# Altium project Camera.PrjPCB
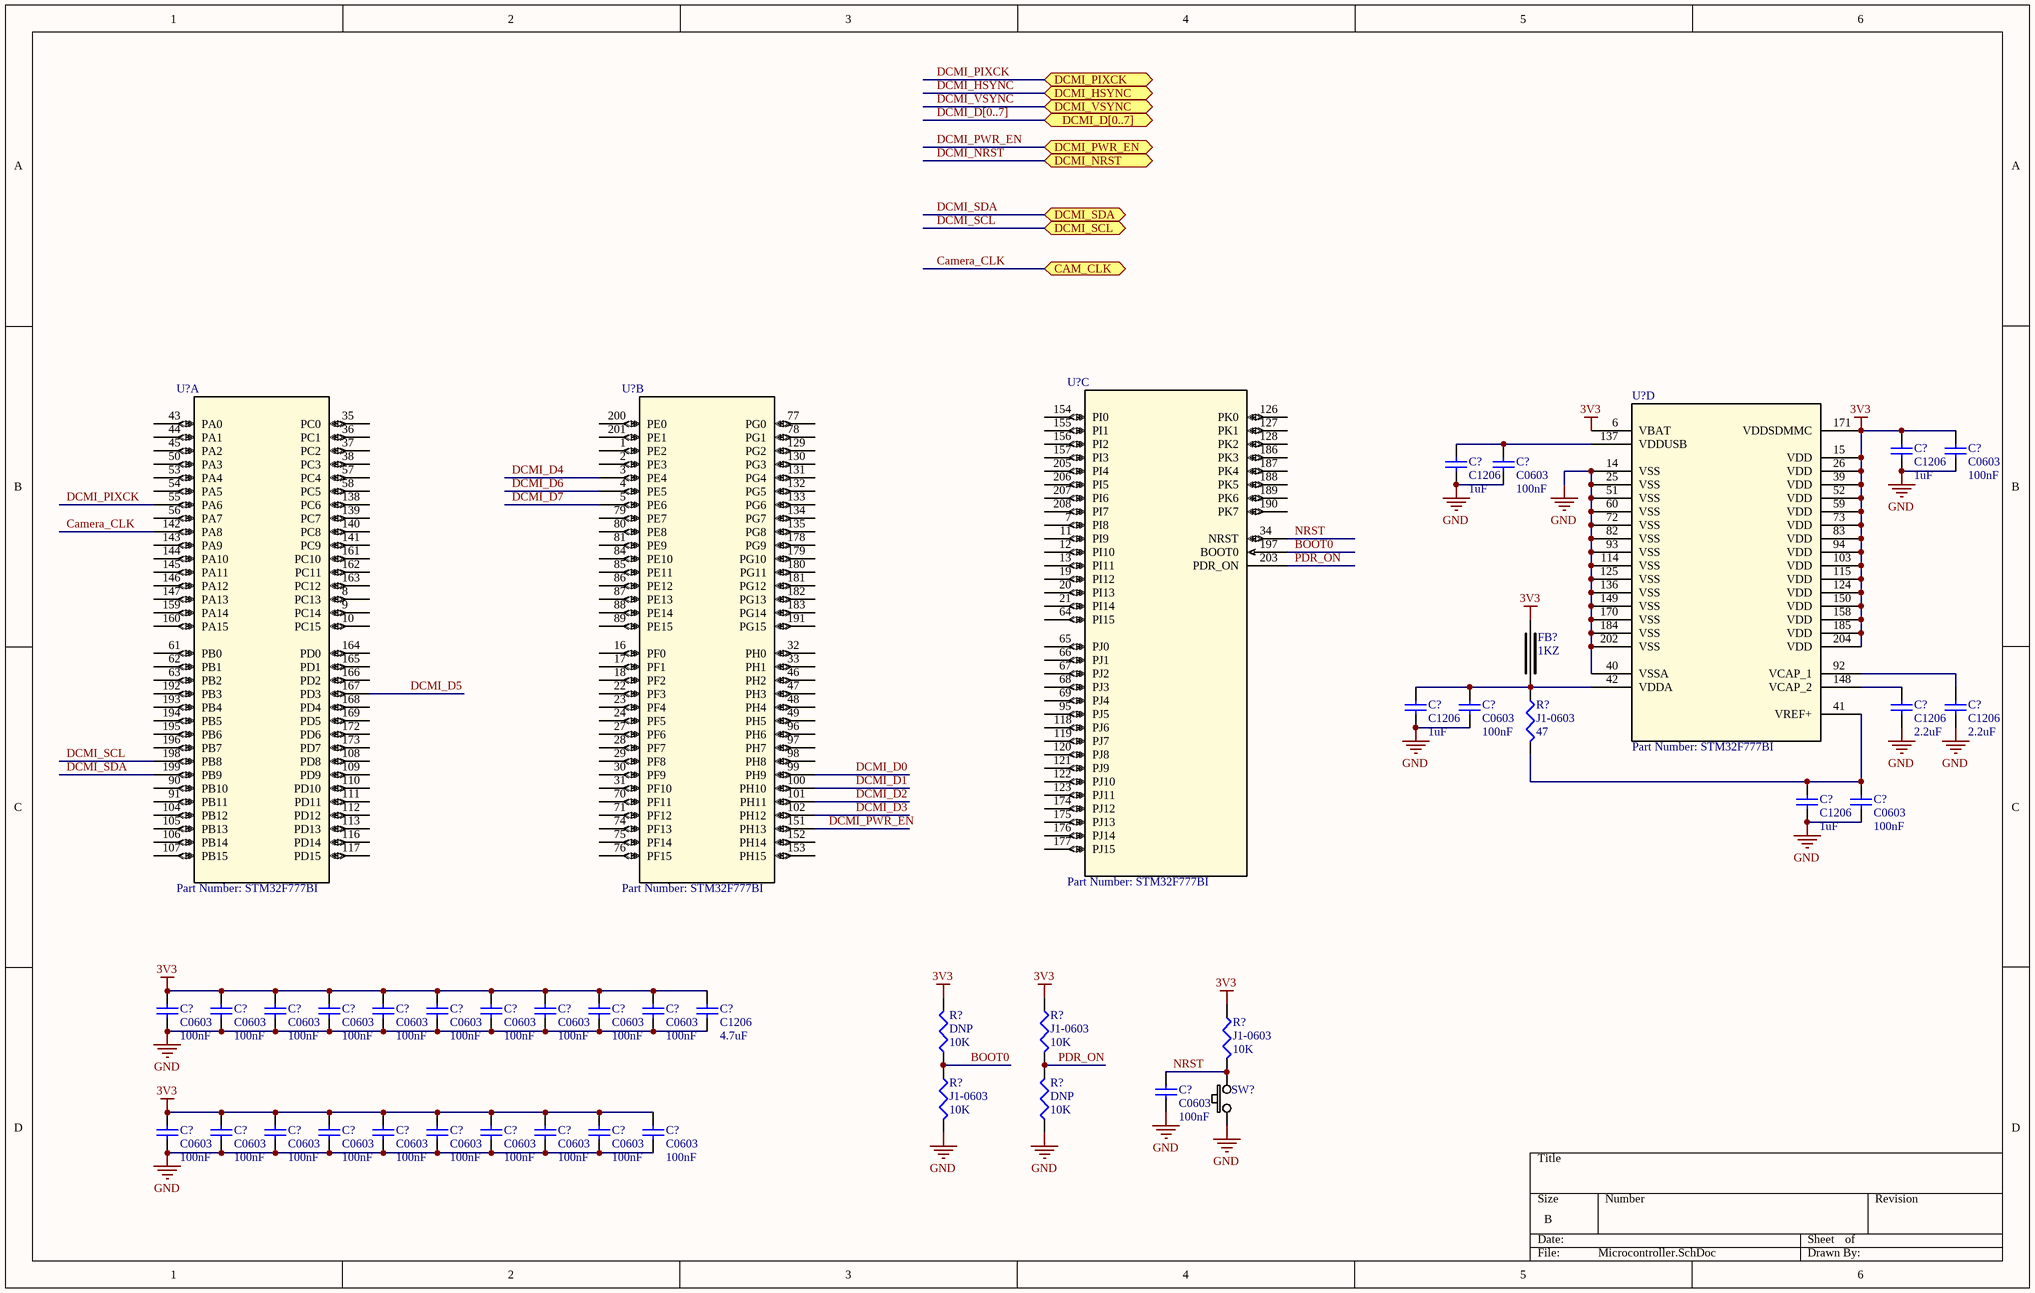
[diagram p0: Microcontroller.SchDoc]
4 sheets, 72 parts. Net scope: flat (ports and power ports of the same name join across sheets).
Sheets:
  Microcontroller.SchDoc
  Camera.SchDoc
  LCD.SchDoc
  Memory.SchDoc

## Sheet Microcontroller.SchDoc
size B

### Parts
(Parts that share a designator on the sheet are numbered #1, #2 ... from top to bottom, then left to right.)
C?#1  C1206  value 1uF  [C1206]
C?#2  C0603  value 100nF  [1608[0603]]
C?#3  C1206  value 1uF  [C1206]
C?#4  C0603  value 100nF  [1608[0603]]
C?#5  C1206  value 1uF  [C1206]
C?#6  C0603  value 100nF  [1608[0603]]
C?#7  C1206  value 2.2uF  [C1206]
C?#8  C1206  value 2.2uF  [C1206]
C?#9  C1206  value 1uF  [C1206]
C?#10  C0603  value 100nF  [1608[0603]]
C?#11  C0603  value 100nF  [1608[0603]]
C?#12  C0603  value 100nF  [1608[0603]]
C?#13  C0603  value 100nF  [1608[0603]]
C?#14  C0603  value 100nF  [1608[0603]]
C?#15  C0603  value 100nF  [1608[0603]]
C?#16  C0603  value 100nF  [1608[0603]]
C?#17  C0603  value 100nF  [1608[0603]]
C?#18  C0603  value 100nF  [1608[0603]]
C?#19  C0603  value 100nF  [1608[0603]]
C?#20  C0603  value 100nF  [1608[0603]]
C?#21  C1206  value 4.7uF  [C1206]
C?#22  C0603  value 100nF  [1608[0603]]
C?#23  C0603  value 100nF  [1608[0603]]
C?#24  C0603  value 100nF  [1608[0603]]
C?#25  C0603  value 100nF  [1608[0603]]
C?#26  C0603  value 100nF  [1608[0603]]
C?#27  C0603  value 100nF  [1608[0603]]
C?#28  C0603  value 100nF  [1608[0603]]
C?#29  C0603  value 100nF  [1608[0603]]
C?#30  C0603  value 100nF  [1608[0603]]
C?#31  C0603  value 100nF  [1608[0603]]
C?#32  C0603  value 100nF  [1608[0603]]
FB?  1KZ  [0603FB-1KZ]
R?#1  J1-0603  value 47  [RESC1608X06N]
R?#2  J1-0603  value 10K  [RESC1608X06N]
R?#3  J1-0603  value 10K  [RESC1608X06N]
R?#4  DNP  value 10K  [RESC1608X06N]
R?#5  J1-0603  value 10K  [RESC1608X06N]
R?#6  DNP  value 10K  [RESC1608X06N]
SW?  SW-PB-BLACK-SMD  [SW-PB-SMD]  (value not drawn)
U?#1  Part Number: STM32F777BI  [LQFP-208_28X28]  (part C of 4)
U?#2  Part Number: STM32F777BI  [LQFP-208_28X28]  (part A of 4)
U?#3  Part Number: STM32F777BI  [LQFP-208_28X28]  (part B of 4)
U?#4  Part Number: STM32F777BI  [LQFP-208_28X28]  (part D of 4)

### Ports
CAM_CLK, DCMI_D[0..7], DCMI_HSYNC, DCMI_NRST, DCMI_PIXCK, DCMI_PWR_EN, DCMI_SCL, DCMI_SDA, DCMI_VSYNC

### Nets
3V3: C?#1.2 C?#2.2 C?#11.2 C?#12.2 C?#13.2 C?#14.2 C?#15.2 C?#16.2 C?#17.2 C?#18.2 C?#19.2 C?#20.2 C?#21.2 C?#23.2 C?#24.2 C?#25.2 C?#26.2 C?#27.2 C?#28.2 C?#29.2 C?#30.2 C?#31.2 C?#32.2 FB?.1 R?#2.1 R?#3.1 R?#4.2 U?#4.6(VBAT) U?#4.15(VDD) U?#4.26(VDD) U?#4.39(VDD) U?#4.52(VDD) U?#4.59(VDD) U?#4.73(VDD) U?#4.83(VDD) U?#4.94(VDD) U?#4.103(VDD) U?#4.115(VDD) U?#4.124(VDD) U?#4.150(VDD) U?#4.158(VDD) U?#4.171(VDDSDMMC) U?#4.185(VDD) U?#4.204(VDD)
GND: C?#1.1 C?#2.1 C?#3.1 C?#4.1 C?#5.1 C?#6.1 C?#7.1 C?#8.1 C?#9.1 C?#10.1 C?#11.1 C?#12.1 C?#13.1 C?#14.1 C?#15.1 C?#16.1 C?#17.1 C?#18.1 C?#19.1 C?#20.1 C?#21.1 C?#22.1 C?#23.1 C?#24.1 C?#25.1 C?#26.1 C?#27.1 C?#28.1 C?#29.1 C?#30.1 C?#31.1 C?#32.1 R?#5.2 R?#6.1 SW?.1 U?#4.14(VSS) U?#4.25(VSS) U?#4.40(VSSA) U?#4.51(VSS) U?#4.60(VSS) U?#4.72(VSS) U?#4.82(VSS) U?#4.93(VSS) U?#4.114(VSS) U?#4.125(VSS) U?#4.136(VSS) U?#4.149(VSS) U?#4.170(VSS) U?#4.184(VSS) U?#4.202(VSS)
BOOT0: R?#4.1 R?#5.1 U?#1.197(BOOT0)
Camera_CLK: U?#2.142(PA8) ; port CAM_CLK
DCMI_D0: U?#3.99(PH9)
DCMI_D1: U?#3.100(PH10)
DCMI_D2: U?#3.101(PH11)
DCMI_D3: U?#3.102(PH12)
DCMI_D4: U?#3.3(PE4)
DCMI_D5: U?#2.167(PD3)
DCMI_D6: U?#3.4(PE5)
DCMI_D7: U?#3.5(PE6)
DCMI_PIXCK: U?#2.55(PA6) ; port DCMI_PIXCK
DCMI_PWR_EN: U?#3.151(PH13) ; port DCMI_PWR_EN
DCMI_SCL: U?#2.198(PB8) ; port DCMI_SCL
DCMI_SDA: U?#2.199(PB9) ; port DCMI_SDA
NRST: C?#22.2 R?#3.2 SW?.2 U?#1.34(NRST)
PDR_ON: R?#2.2 R?#6.2 U?#1.203(PDR_ON)
NetC?#3_2: C?#3.2 C?#4.2 U?#4.137(VDDUSB)
NetC?#5_2: C?#5.2 C?#6.2 FB?.2 R?#1.1 U?#4.42(VDDA)
NetC?#7_2: C?#7.2 U?#4.148(VCAP_2)
NetC?#8_2: C?#8.2 U?#4.92(VCAP_1)
NetC?#9_2: C?#9.2 C?#10.2 R?#1.2 U?#4.41(VREF+)

Not connected (* = marked no-connect by the designer): U?#1 7(PI8) 11(PI9) 12(PI10) 13(PI11) 19(PI12) 20(PI13) 21(PI14) 64(PI15) 65(PJ0) 66(PJ1) 67(PJ2) 68(PJ3) 69(PJ4) 95(PJ5) 118(PJ6) 119(PJ7) 120(PJ8) 121(PJ9) 122(PJ10) 123(PJ11) 126(PK0) 127(PK1) 128(PK2) 154(PI0) 155(PI1) 156(PI2) 157(PI3) 174(PJ12) 175(PJ13) 176(PJ14) 177(PJ15) 186(PK3) 187(PK4) 188(PK5) 189(PK6) 190(PK7) 205(PI4) 206(PI5) 207(PI6) 208(PI7); U?#2 8(PC13) 9(PC14) 10(PC15) 35(PC0) 36(PC1) 37(PC2) 38(PC3) 43(PA0) 44(PA1) 45(PA2) 50(PA3) 53(PA4) 54(PA5) 56(PA7) 57(PC4) 58(PC5) 61(PB0) 62(PB1) 63(PB2) 90(PB10) 91(PB11) 104(PB12) 105(PB13) 106(PB14) 107(PB15) 108(PD8) 109(PD9) 110(PD10) 111(PD11) 112(PD12) 113(PD13) 116(PD14) 117(PD15) 138(PC6) 139(PC7) 140(PC8) 141(PC9) 143(PA9) 144(PA10) 145(PA11) 146(PA12) 147(PA13) 159(PA14) 160(PA15) 161(PC10) 162(PC11) 163(PC12) 164(PD0) 165(PD1) 166(PD2) 168(PD4) 169(PD5) 172(PD6) 173(PD7) 192(PB3) 193(PB4) 194(PB5) 195(PB6) 196(PB7); U?#3 1(PE2) 2(PE3) 16(PF0) 17(PF1) 18(PF2) 22(PF3) 23(PF4) 24(PF5) 27(PF6) 28(PF7) 29(PF8) 30(PF9) 31(PF10) 32(PH0) 33(PH1) 46(PH2) 47(PH3) 48(PH4) 49(PH5) 70(PF11) 71(PF12) 74(PF13) 75(PF14) 76(PF15) 77(PG0) 78(PG1) 79(PE7) 80(PE8) 81(PE9) 84(PE10) 85(PE11) 86(PE12) 87(PE13) 88(PE14) 89(PE15) 96(PH6) 97(PH7) 98(PH8) 129(PG2) 130(PG3) 131(PG4) 132(PG5) 133(PG6) 134(PG7) 135(PG8) 152(PH14) 153(PH15) 178(PG9) 179(PG10) 180(PG11) 181(PG12) 182(PG13) 183(PG14) 191(PG15) 200(PE0) 201(PE1)

### Buses and harness runs
bus DCMI_D[0..7] = port DCMI_D[0..7]

### Library data of the parts
C?#1-C?#32 = Cap Semi: Capacitor (Semiconductor SIM Model); Published: 8-Jun-2000; LatestRevisionDate: 29-May-2009; LatestRevisionNote: IPC-7351 Footprint Added.; Publisher: Altium Limited; PackageDescription: Chip Capacitor
  C?#1 C?#3 C?#5 C?#7-C?#9 C?#21: PackageReference: C1206
  C?#2 C?#4 C?#6 C?#10-C?#20 C?#22-C?#32: PackageReference: C0603
FB? = 0603FB-1KZ: FERRITE BEAD 1000 OHM 400mA; Manufacturer: TDK Corporation; Manufacturer Part Number: MMZ1608R102A; Reel: F1; Description: FERRITE CHIP 1000 OHM 400MA 0603; Supplier 1: Digi-Key; Supplier Part Number 1: 445-1548-2-ND
R?#1-R?#6 = Res3: Resistor; Published: 8-Jun-2000; LatestRevisionDate: 29-May-2009; LatestRevisionNote: IPC-7351 Footprint Added.; PackageReference: J1-0603; Publisher: Altium Limited; PackageDescription: Chip Resistor
SW? = SW-PB-BLACK-SMD: PUSHBUTTON SWITCH 6MM SMD
U?#1-U?#4 = STM32F77XBXT: No Description Available; Vendor: STMicroelectronics; Manufacturer_Part_Number: STM32F777BI; Copyright: Copyright (C) 2016 Accelerated Designs. All rights reserved; RefDes: RefDes; Type: DEV; Value: Value

## Sheet Camera.SchDoc
size B
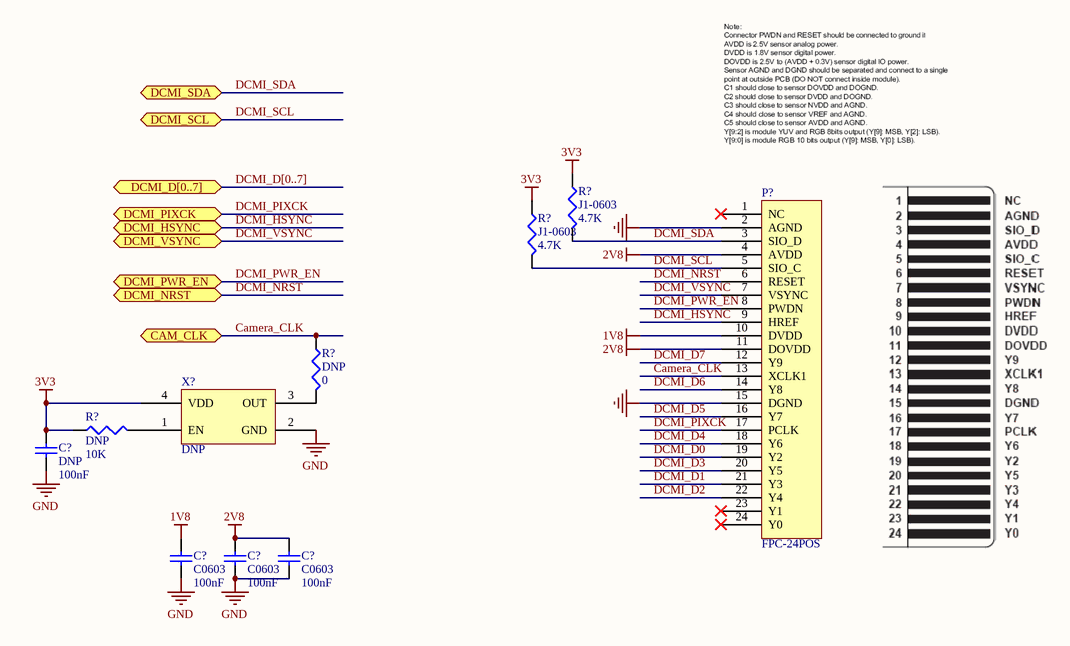
[diagram p1: Camera.SchDoc]

### Parts
(Parts that share a designator on the sheet are numbered #1, #2 ... from top to bottom, then left to right.)
C?#33  DNP  value 100nF  [1608[0603]]
C?#34  C0603  value 100nF  [1608[0603]]
C?#35  C0603  value 100nF  [1608[0603]]
C?#36  C0603  value 100nF  [1608[0603]]
P?  FPC-24POS
R?#7  J1-0603  value 4.7K  [RESC1608X06N]
R?#8  J1-0603  value 4.7K  [RESC1608X06N]
R?#9  DNP  value 0  [RESC1608X06N]
R?#10  DNP  value 10K  [RESC1608X06N]
X?  DNP  [XOSC-5X7]

### Ports
CAM_CLK, DCMI_D[0..7], DCMI_HSYNC, DCMI_NRST, DCMI_PIXCK, DCMI_PWR_EN, DCMI_SCL, DCMI_SDA, DCMI_VSYNC

### Nets
1V8: C?#34.2 P?.10(DVDD)
2V8: C?#35.2 C?#36.2 P?.4(AVDD) P?.11(DOVDD)
3V3: C?#33.2 R?#7.1 R?#8.1 R?#10.1 X?.4(VDD)
GND: C?#33.1 C?#34.1 C?#35.1 C?#36.1 P?.2(AGND) P?.15(DGND) X?.2(GND)
Camera_CLK: P?.13(XCLK1) R?#9.1 ; port CAM_CLK
DCMI_D0: P?.19(Y2)
DCMI_D1: P?.21(Y3)
DCMI_D2: P?.22(Y4)
DCMI_D3: P?.20(Y5)
DCMI_D4: P?.18(Y6)
DCMI_D5: P?.16(Y7)
DCMI_D6: P?.14(Y8)
DCMI_D7: P?.12(Y9)
DCMI_HSYNC: P?.9(HREF) ; port DCMI_HSYNC
DCMI_NRST: P?.6(RESET) ; port DCMI_NRST
DCMI_PIXCK: P?.17(PCLK) ; port DCMI_PIXCK
DCMI_PWR_EN: P?.8(PWDN) ; port DCMI_PWR_EN
DCMI_SCL: P?.5(SIO_C) R?#8.2 ; port DCMI_SCL
DCMI_SDA: P?.3(SIO_D) R?#7.2 ; port DCMI_SDA
DCMI_VSYNC: P?.7(VSYNC) ; port DCMI_VSYNC
NetR?#9_2: R?#9.2 X?.3(OUT)
NetR?#10_2: R?#10.2 X?.1(EN)

Not connected (* = marked no-connect by the designer): P? 1(NC)* 23(Y1)* 24(Y0)*

### Buses and harness runs
bus DCMI_D[0..7] = port DCMI_D[0..7]

### Library data of the parts
C?#33-C?#36 = Cap Semi: Capacitor (Semiconductor SIM Model); Published: 8-Jun-2000; LatestRevisionDate: 29-May-2009; LatestRevisionNote: IPC-7351 Footprint Added.; PackageReference: C0603; Publisher: Altium Limited; PackageDescription: Chip Capacitor
P? = CONN-FPC-24POS: 24POS Flat Printed Circuit (FPC) Connector; Suppler Part Number 1: SFV24R-4STBE1HLF
R?#7-R?#10 = Res3: Resistor; Published: 8-Jun-2000; LatestRevisionDate: 29-May-2009; LatestRevisionNote: IPC-7351 Footprint Added.; PackageReference: J1-0603; Publisher: Altium Limited; PackageDescription: Chip Resistor
X? = OSC_GENERIC: Generic Crystal Oscillator; frequency: *

## Sheet LCD.SchDoc
size B
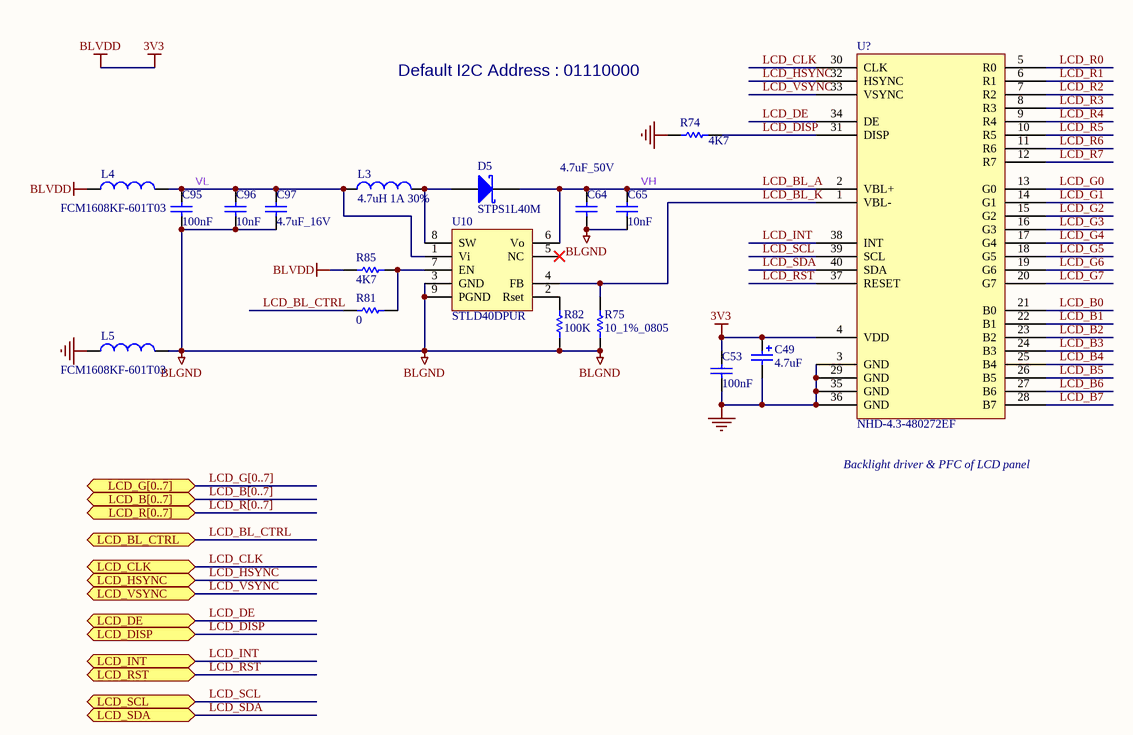
[diagram p2: LCD.SchDoc]

### Parts
(Parts that share a designator on the sheet are numbered #1, #2 ... from top to bottom, then left to right.)
C49  4.7uF  [TAN-A]
C53  100nF  [0402C]
C64  4.7uF_50V  [1206C]
C65  10nF  [0603C]
C95  100nF  [0603C]
C96  10nF  [0603C]
C97  4.7uF_16V  [1206C]
D5  STPS1L40M  [DO216-AA]
L3  4.7uH 1A 30%  [1210L]
L4  FCM1608KF-601T03  [0603L]
L5  FCM1608KF-601T03  [0603L]
R74  4K7  [0402R]
R75  10_1%_0805  [0805R]
R81  0  [0402R]
R82  100K  [0402R]
R85  4K7  [0402R]
U10  STLD40DPUR  [QFN8_0R65_3X3_ST]
U?#5  NHD-4.3-480272EF  [RK043FN48H]

### Ports
LCD_B[0..7], LCD_BL_CTRL, LCD_CLK, LCD_DE, LCD_DISP, LCD_G[0..7], LCD_HSYNC, LCD_INT, LCD_R[0..7], LCD_RST, LCD_SCL, LCD_SDA, LCD_VSYNC

### Nets
3V3: C49.1 C53.2 L4.1 R85.2 U?#5.4(VDD)  [also labelled BLVDD]
BLGND: C64.2 C65.1 C95.1 C96.1 C97.2 L5.2 R75.1 R82.2 U10.3(GND) U10.9(PGND)
GND: C49.2 C53.1 L5.1 R74.2 U?#5.3(GND) U?#5.29(GND) U?#5.35(GND) U?#5.36(GND)
LCD_B0: U?#5.21(B0)
LCD_B1: U?#5.22(B1)
LCD_B2: U?#5.23(B2)
LCD_B3: U?#5.24(B3)
LCD_B4: U?#5.25(B4)
LCD_B5: U?#5.26(B5)
LCD_B6: U?#5.27(B6)
LCD_B7: U?#5.28(B7)
LCD_BL_A: C64.1 C65.2 D5.2(K) U10.6(Vo) U?#5.2(VBL+)  [also labelled VH]
LCD_BL_CTRL: R81.2 ; port LCD_BL_CTRL
LCD_BL_K: R75.2 U10.4(FB) U?#5.1(VBL-)
LCD_CLK: U?#5.30(CLK) ; port LCD_CLK
LCD_DE: U?#5.34(DE) ; port LCD_DE
LCD_DISP: R74.1 U?#5.31(DISP) ; port LCD_DISP
LCD_G0: U?#5.13(G0)
LCD_G1: U?#5.14(G1)
LCD_G2: U?#5.15(G2)
LCD_G3: U?#5.16(G3)
LCD_G4: U?#5.17(G4)
LCD_G5: U?#5.18(G5)
LCD_G6: U?#5.19(G6)
LCD_G7: U?#5.20(G7)
LCD_HSYNC: U?#5.32(HSYNC) ; port LCD_HSYNC
LCD_INT: U?#5.38(INT) ; port LCD_INT
LCD_R0: U?#5.5(R0)
LCD_R1: U?#5.6(R1)
LCD_R2: U?#5.7(R2)
LCD_R3: U?#5.8(R3)
LCD_R4: U?#5.9(R4)
LCD_R5: U?#5.10(R5)
LCD_R6: U?#5.11(R6)
LCD_R7: U?#5.12(R7)
LCD_RST: U?#5.37(RESET) ; port LCD_RST
LCD_SCL: U?#5.39(SCL) ; port LCD_SCL
LCD_SDA: U?#5.40(SDA) ; port LCD_SDA
LCD_VSYNC: U?#5.33(VSYNC) ; port LCD_VSYNC
VL: C95.2 C96.2 C97.1 L3.1 L4.2 U10.1(Vi)
NetD5_1: D5.1(A) L3.2 U10.8(SW)
NetR81_1: R81.1 R85.1 U10.7(EN)
NetR82_1: R82.1 U10.2(Rset)

Not connected (* = marked no-connect by the designer): U10 5(NC)*

### Buses and harness runs
bus LCD_B[0..7] = port LCD_B[0..7]
bus LCD_G[0..7] = port LCD_G[0..7]
bus LCD_R[0..7] = port LCD_R[0..7]

### Notes on the sheet
- Default I2C Address : 01110000
- Backlight driver & PFC of LCD panel

### Library data of the parts
C49 = Cap_4.7uF_POL_10%_TANA: Polarized Capacitor,4.7uF,16V,10%,typeA,AVX; Manuf_Part_1: TAJA475K016R; Revision: July-2002: Re-released for DXP Platform.; Value: 4.7uF; Manuf_1: AVX; Order: TAJA475K016R; ECCN_US/EU: n/a
C53 = Cap_100nF_X7R_10%_0402: Capacitor,100nF,16V,X7R,10%,0402,YAGEO; Manuf_Part_1: CC0402KRX7R7BB104; Revision: July-2002: Re-released for DXP Platform.; Value: 100nF; Order: CC0402KRX7R7BB104; Manuf_1: YAGEO; ECCN_US/EU: n/a
C64 = Cap_4.7uF_X7R_10%_1206: Capacitor,4.7uF,50V, X7R,10%,1206,AVX; Manuf_Part_1: 12065C475KAT2A; Revision: July-2002: Re-released for DXP Platform.; Value: 4.7uF; Order: *; Manuf_1: AVX; ECCN_US/EU: n/a; Distrib: FARNELL
C65 C96 = Cap_10nF_X7R_10%_0603: Capacitor,10nF,50V,X7R,10%,0603,YAGEO; Manuf_Part_1: CC0603KRX7R9BB103; Revision: July-2002: Re-released for DXP Platform.; Value: 10nF; Order: CC0603KRX7R9BB103; Manuf_1: YAGEO; ECCN_US/EU: n/a
C95 = Cap_100nF_X7R_10%_0603: Capacitor,100nF,16V,X7R,10%,0603,YAGEO; Manuf_Part_1: CC0603KRX7R9BB104; Revision: July-2002: Re-released for DXP Platform.; Value: 100nF; Order: CC0603KRX7R9BB104; Manuf_1: YAGEO; ECCN_US/EU: n/a
C97 = Cap_4.7uF_X5R_10%_1206: Capacitor,4.7uF,16V, X5R,10%,1206,AVX; Manuf_Part_1: 1206YD475KAT2A; Revision: July-2002: Re-released for DXP Platform.; Value: 4.7uF; Order: *; Manuf_1: AVX; ECCN_US/EU: n/a; Distrib: FARNELL
D5 = STPS1L40M: Low Drop power Schottky rectifier(1A, 40V, 0.4V); Manuf_1: STM; Provided: ST; Ref St: 9151085; ECCN_US/EU: EAR99/NEC; Manuf_Part_1: STPS1L40M; Order: STPS1L40M; Distrib: ST; Code - JEDEC: *
L3 = Ind_4.7uH_1A_30%: FIXED IND 4.7UH 1A 180 MOHM 30% SMD; Manuf_Part_1: LQH32PN4R7NN0L; Manuf_1: MURATA; Order: 490-5338-1-ND; Distrib: DIGIKEY; ECCN_US/EU: n/a
L4 L5 = BEAD_600R_350MA_0603: Bead,600R,350mA,0603,FCM1608KF-601T03,Tai-tech; Manuf_2: TDK; Manuf_Part_2: MPZ1608S300A; Manuf_Part_3: BLM18PG121SN1D; Manuf_3: MURATA; Value: 100uH; Description_2: Bead,30R,5A,0603,MPZ1608S300A,TDK; Description_3: Bead,120R,2A,0603,BLM18PG121SN1D,MURATA; Revision: July-2002: Re-released for DXP Platform.; Manuf_Part_1: FCM1608KF-601T03; Manuf_1: Tai-tech; ECCN_US/EU: n/a
R74 R85 = Res_4K7_1%_0402: Resistor,4K7,0402,1%,YAGEO; Manuf_Part_1: RT0402FRE074K7L; Value: 4K7; Manuf_1: YAGEO; Order: RT0402FRE074K7L; ECCN_US/EU: n/a
R75 = Res_10_1%_0805: Resistor,10,0805,1%,Stackpole,1/4W; Manuf_Part_1: RNCP0805FTD10R0; Manuf_1: Stackpole Electronics Inc; Value: 10; Order: RNCP0805FTD10R0; ECCN_US/EU: n/a
R81 = Res_0_5%_0402: Resistor,0,0402,5%,YAGEO; Manuf_Part_1: RC0402JR-070RL; Order: 2363467; Value: 0; ECCN_US/EU: n/a; Manuf_1: YAGEO; Distrib: FARNELL
R82 = Res_100K_1%_0402: Resistor,100K,0402,1%,YAGEO; Manuf_Part_1: RT0402FRE07100KL; Value: 100K; Manuf_1: YAGEO; Order: RT0402FRE07100KL; ECCN_US/EU: n/a
U10 = STLD40DPUR: White LED power supply for large display backlight, QFN8; Manuf_1: STM; ECCN_US/EU: EAR99/NEC; Ref St: xxxxxxxxx; Provided: ST; Order: STLD40DPUR; Manuf_Part_1: STLD40DPUR; Distrib: ST
U?#5 = RK043FN48H-CT672B: 4.3 inch TFT 480*272 pixels with LED Backlight, high luminance; Manuf_1: Newhaven Display; Manuf_Part_1: NHD-4.3-480272EF-ATXL#; ECCN_US/EU: EAR99/NEC; Distrib: Sub Co; Description: 4.3 inch TFT 480*272 pixels with LED Backlight; Ref St: *

## Sheet Memory.SchDoc
size B

## Nets that join several sheets
3V3: Microcontroller (44 pins), Camera (5 pins), LCD (5 pins)
GND: Microcontroller (50 pins), Camera (7 pins), LCD (8 pins)
Camera_CLK: Microcontroller (U?#2.142), Camera (P?.13 R?#9.1)
DCMI_D0: Microcontroller (U?#3.99), Camera (P?.19)
DCMI_D1: Microcontroller (U?#3.100), Camera (P?.21)
DCMI_D2: Microcontroller (U?#3.101), Camera (P?.22)
DCMI_D3: Microcontroller (U?#3.102), Camera (P?.20)
DCMI_D4: Microcontroller (U?#3.3), Camera (P?.18)
DCMI_D5: Microcontroller (U?#2.167), Camera (P?.16)
DCMI_D6: Microcontroller (U?#3.4), Camera (P?.14)
DCMI_D7: Microcontroller (U?#3.5), Camera (P?.12)
DCMI_PIXCK: Microcontroller (U?#2.55), Camera (P?.17)
DCMI_PWR_EN: Microcontroller (U?#3.151), Camera (P?.8)
DCMI_SCL: Microcontroller (U?#2.198), Camera (P?.5 R?#8.2)
DCMI_SDA: Microcontroller (U?#2.199), Camera (P?.3 R?#7.2)